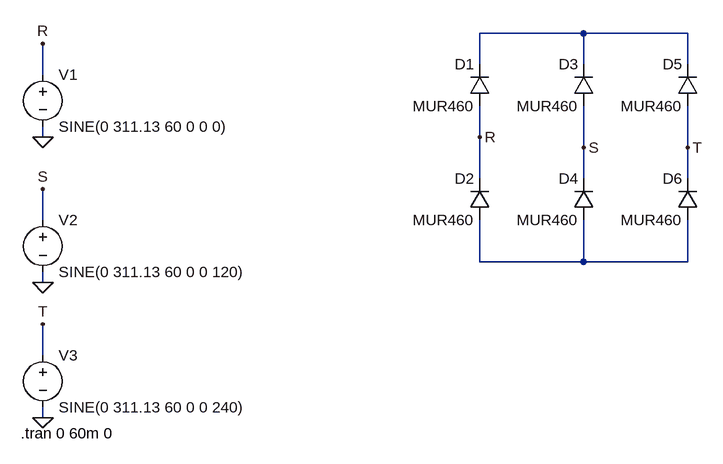
[diagram p0: schematic retificacao.asc]
retificacao.asc, the LTspice schematic file:
Version 4
SHEET 1 1420 680
WIRE 912 48 752 48
WIRE 1072 48 912 48
WIRE 752 96 752 48
WIRE 912 96 912 48
WIRE 1072 96 1072 48
WIRE 80 112 80 64
WIRE 80 208 80 192
WIRE 752 208 752 160
WIRE 912 224 912 160
WIRE 1072 224 1072 160
WIRE 752 272 752 208
WIRE 912 272 912 224
WIRE 1072 272 1072 224
WIRE 80 336 80 288
WIRE 752 400 752 336
WIRE 912 400 912 336
WIRE 912 400 752 400
WIRE 1072 400 1072 336
WIRE 1072 400 912 400
WIRE 80 432 80 416
WIRE 80 544 80 496
WIRE 80 640 80 624
FLAG 80 208 0
FLAG 80 64 R
FLAG 80 432 0
FLAG 80 288 S
FLAG 80 640 0
FLAG 80 496 T
FLAG 752 208 R
FLAG 912 224 S
FLAG 1072 224 T
SYMBOL voltage 80 96 R0
WINDOW 123 0 0 Left 2
WINDOW 39 0 0 Left 2
SYMATTR InstName V1
SYMATTR Value SINE(0 311.13 60 0 0 0)
SYMBOL voltage 80 320 R0
WINDOW 123 0 0 Left 2
WINDOW 39 0 0 Left 2
SYMATTR InstName V2
SYMATTR Value SINE(0 311.13 60 0 0 120)
SYMBOL voltage 80 528 R0
WINDOW 123 0 0 Left 2
WINDOW 39 0 0 Left 2
SYMATTR InstName V3
SYMATTR Value SINE(0 311.13 60 0 0 240)
SYMBOL diode 768 160 R180
WINDOW 0 24 64 Left 2
WINDOW 3 24 0 Left 2
SYMATTR InstName D1
SYMATTR Value MUR460
SYMBOL diode 768 336 R180
WINDOW 0 24 64 Left 2
WINDOW 3 24 0 Left 2
SYMATTR InstName D2
SYMATTR Value MUR460
SYMBOL diode 928 160 R180
WINDOW 0 24 64 Left 2
WINDOW 3 24 0 Left 2
SYMATTR InstName D3
SYMATTR Value MUR460
SYMBOL diode 928 336 R180
WINDOW 0 24 64 Left 2
WINDOW 3 24 0 Left 2
SYMATTR InstName D4
SYMATTR Value MUR460
SYMBOL diode 1088 160 R180
WINDOW 0 24 64 Left 2
WINDOW 3 24 0 Left 2
SYMATTR InstName D5
SYMATTR Value MUR460
SYMBOL diode 1088 336 R180
WINDOW 0 24 64 Left 2
WINDOW 3 24 0 Left 2
SYMATTR InstName D6
SYMATTR Value MUR460
TEXT 46 664 Left 2 !.tran 0 60m 0

The netlist it stands for:
* retificacao.asc
V1 R 0 SINE(0 311.13 60 0 0 0)
V2 S 0 SINE(0 311.13 60 0 0 120)
V3 T 0 SINE(0 311.13 60 0 0 240)
D1 R N001 MUR460
D2 N002 R MUR460
D3 S N001 MUR460
D4 N002 S MUR460
D5 T N001 MUR460
D6 N002 T MUR460
.model D D
.lib standard.dio
.tran 0 60m 0
.backanno
.end